# Altium schematic sheet Drivers - High Current.SchDoc: High Current Drivers
size Letter; Date: 2017-02-17; Revision: A; SheetNumber: 5; SheetTotal: 11; ProjectTitle: PDUv17: Power Distribution Unit
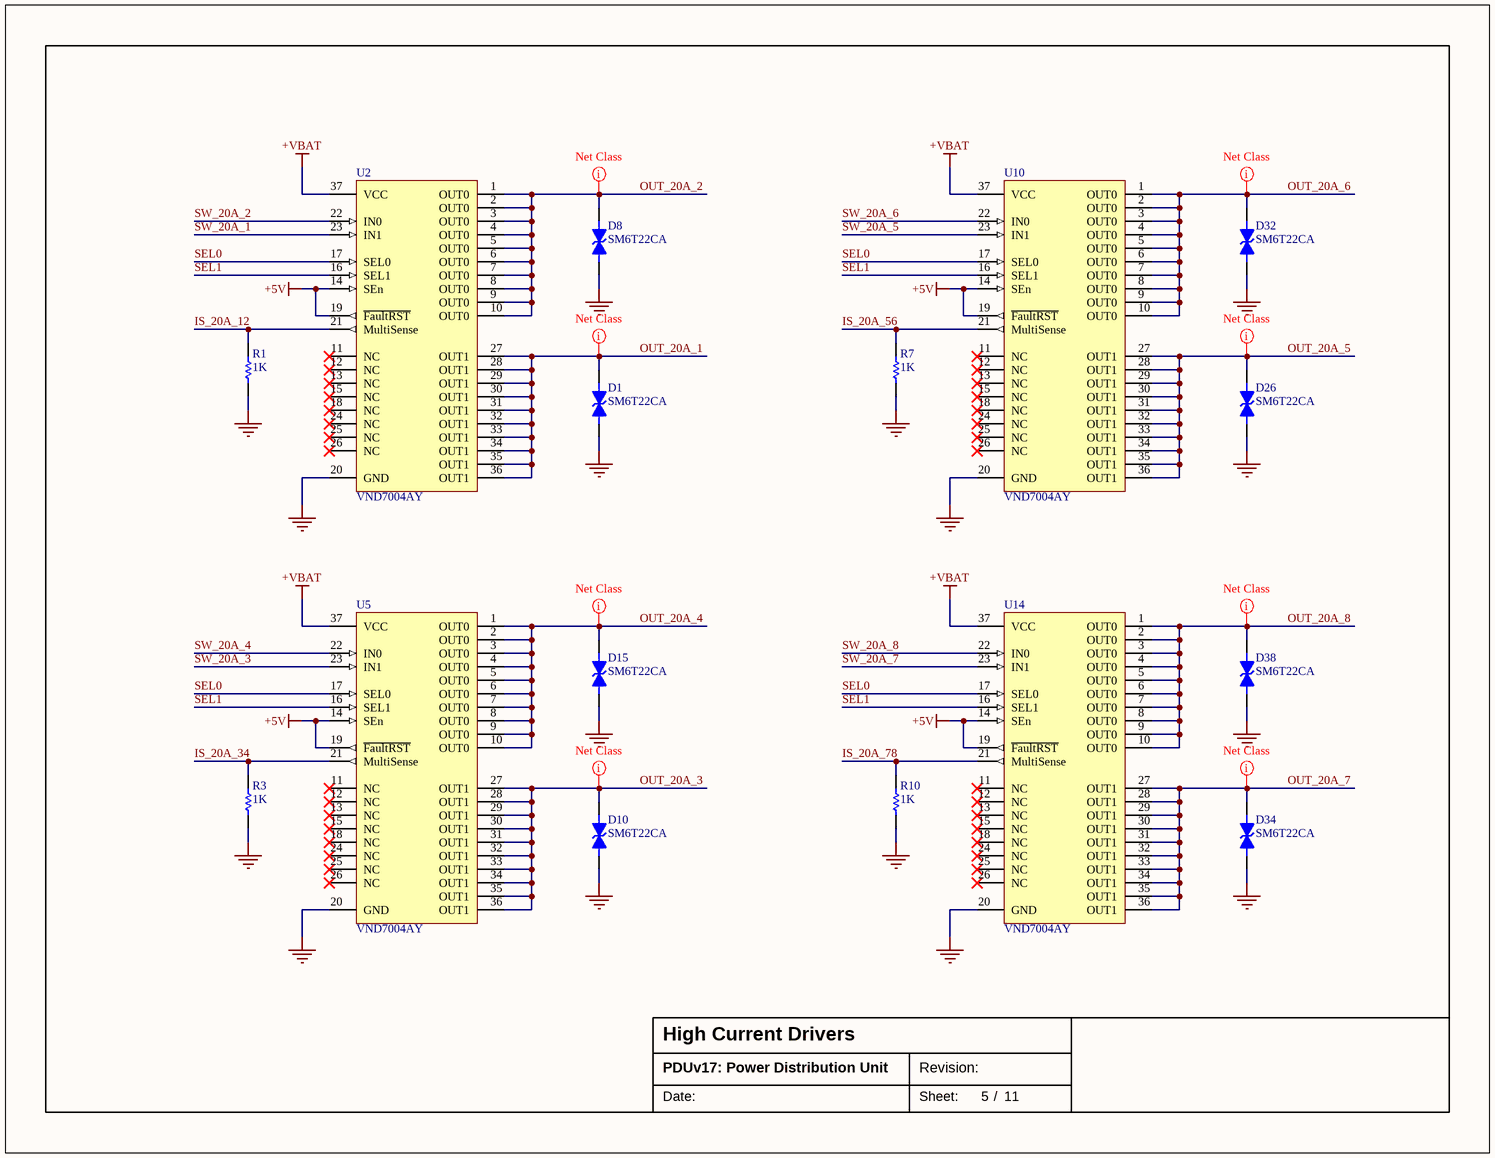
[diagram p0: Drivers - High Current.SchDoc]

## Parts
D1  SM6T22CA  [SM6T]
D8  SM6T22CA  [SM6T]
D10  SM6T22CA  [SM6T]
D15  SM6T22CA  [SM6T]
D26  SM6T22CA  [SM6T]
D32  SM6T22CA  [SM6T]
D34  SM6T22CA  [SM6T]
D38  SM6T22CA  [SM6T]
R1  value 1K  [RES-0603-M]  (hidden comment: RES 1K 1% 1/10 W 0603 ±100ppm/°C)
R3  value 1K  [RES-0603-M]  (hidden comment: RES 1K 1% 1/10 W 0603 ±100ppm/°C)
R7  value 1K  [RES-0603-M]  (hidden comment: RES 1K 1% 1/10 W 0603 ±100ppm/°C)
R10  value 1K  [RES-0603-M]  (hidden comment: RES 1K 1% 1/10 W 0603 ±100ppm/°C)
U2  VND7004AY  [SSOP50P1030X265_HS-37N]
U5  VND7004AY  [SSOP50P1030X265_HS-37N]
U10  VND7004AY  [SSOP50P1030X265_HS-37N]
U14  VND7004AY  [SSOP50P1030X265_HS-37N]

## Nets
+5V: U2.14(SEn) U2.19(~{FaultRST}) U5.14(SEn) U5.19(~{FaultRST}) U10.14(SEn) U10.19(~{FaultRST}) U14.14(SEn) U14.19(~{FaultRST})
+VBAT: U2.37(VCC) U5.37(VCC) U10.37(VCC) U14.37(VCC)
GND: D1.1(K) D8.1(K) D10.1(K) D15.1(K) D26.1(K) D32.1(K) D34.1(K) D38.1(K) R1.1 R3.1 R7.1 R10.1 U2.20(GND) U5.20(GND) U10.20(GND) U14.20(GND)
IS_20A_12: R1.2 U2.21(MultiSense)
IS_20A_34: R3.2 U5.21(MultiSense)
IS_20A_56: R7.2 U10.21(MultiSense)
IS_20A_78: R10.2 U14.21(MultiSense)
OUT_20A_1: D1.2(A) U2.27(OUT1) U2.28(OUT1) U2.29(OUT1) U2.30(OUT1) U2.31(OUT1) U2.32(OUT1) U2.33(OUT1) U2.34(OUT1) U2.35(OUT1) U2.36(OUT1)
OUT_20A_2: D8.2(A) U2.1(OUT0) U2.2(OUT0) U2.3(OUT0) U2.4(OUT0) U2.5(OUT0) U2.6(OUT0) U2.7(OUT0) U2.8(OUT0) U2.9(OUT0) U2.10(OUT0)
OUT_20A_3: D10.2(A) U5.27(OUT1) U5.28(OUT1) U5.29(OUT1) U5.30(OUT1) U5.31(OUT1) U5.32(OUT1) U5.33(OUT1) U5.34(OUT1) U5.35(OUT1) U5.36(OUT1)
OUT_20A_4: D15.2(A) U5.1(OUT0) U5.2(OUT0) U5.3(OUT0) U5.4(OUT0) U5.5(OUT0) U5.6(OUT0) U5.7(OUT0) U5.8(OUT0) U5.9(OUT0) U5.10(OUT0)
OUT_20A_5: D26.2(A) U10.27(OUT1) U10.28(OUT1) U10.29(OUT1) U10.30(OUT1) U10.31(OUT1) U10.32(OUT1) U10.33(OUT1) U10.34(OUT1) U10.35(OUT1) U10.36(OUT1)
OUT_20A_6: D32.2(A) U10.1(OUT0) U10.2(OUT0) U10.3(OUT0) U10.4(OUT0) U10.5(OUT0) U10.6(OUT0) U10.7(OUT0) U10.8(OUT0) U10.9(OUT0) U10.10(OUT0)
OUT_20A_7: D34.2(A) U14.27(OUT1) U14.28(OUT1) U14.29(OUT1) U14.30(OUT1) U14.31(OUT1) U14.32(OUT1) U14.33(OUT1) U14.34(OUT1) U14.35(OUT1) U14.36(OUT1)
OUT_20A_8: D38.2(A) U14.1(OUT0) U14.2(OUT0) U14.3(OUT0) U14.4(OUT0) U14.5(OUT0) U14.6(OUT0) U14.7(OUT0) U14.8(OUT0) U14.9(OUT0) U14.10(OUT0)
SEL0: U2.17(SEL0) U5.17(SEL0) U10.17(SEL0) U14.17(SEL0)
SEL1: U2.16(SEL1) U5.16(SEL1) U10.16(SEL1) U14.16(SEL1)
SW_20A_1: U2.23(IN1)
SW_20A_2: U2.22(IN0)
SW_20A_3: U5.23(IN1)
SW_20A_4: U5.22(IN0)
SW_20A_5: U10.23(IN1)
SW_20A_6: U10.22(IN0)
SW_20A_7: U14.23(IN1)
SW_20A_8: U14.22(IN0)

Not connected (* = marked no-connect by the designer): U2 11(NC)* 12(NC)* 13(NC)* 15(NC)* 18(NC)* 24(NC)* 25(NC)* 26(NC)*; U5 11(NC)* 12(NC)* 13(NC)* 15(NC)* 18(NC)* 24(NC)* 25(NC)* 26(NC)*; U10 11(NC)* 12(NC)* 13(NC)* 15(NC)* 18(NC)* 24(NC)* 25(NC)* 26(NC)*; U14 11(NC)* 12(NC)* 13(NC)* 15(NC)* 18(NC)* 24(NC)* 25(NC)* 26(NC)*

## Layout directives
net class OUT_20A: OUT_20A_1, OUT_20A_2, OUT_20A_3, OUT_20A_4, OUT_20A_5, OUT_20A_6, OUT_20A_7, OUT_20A_8

## Notes on the sheet
- Date:
- Revision:
- Sheet:
- /

## Library data of the parts
R1 R3 R7 R10 = RC0603FR-071KL: Manufacturer: Yageo; Manufacturer Series: RC; Power: 1/10 W; Part Number: RC0603FR-071KL; Component Type: Standard; Tolerance: 1%; Package: 0603; Temperature Coefficient: ±100ppm/°C; Temperature Range: -55°C ~ 155°C; Supplier 1: Digi-Key; Supplier Part Number 1: 311-1.00KHRCT-ND
D1 D8 D10 D15 D26 D32 D34 D38 = SM6T22CA: Supplier 1: Digi-Key; Supplier Part Number 1: 497-3507-1-ND